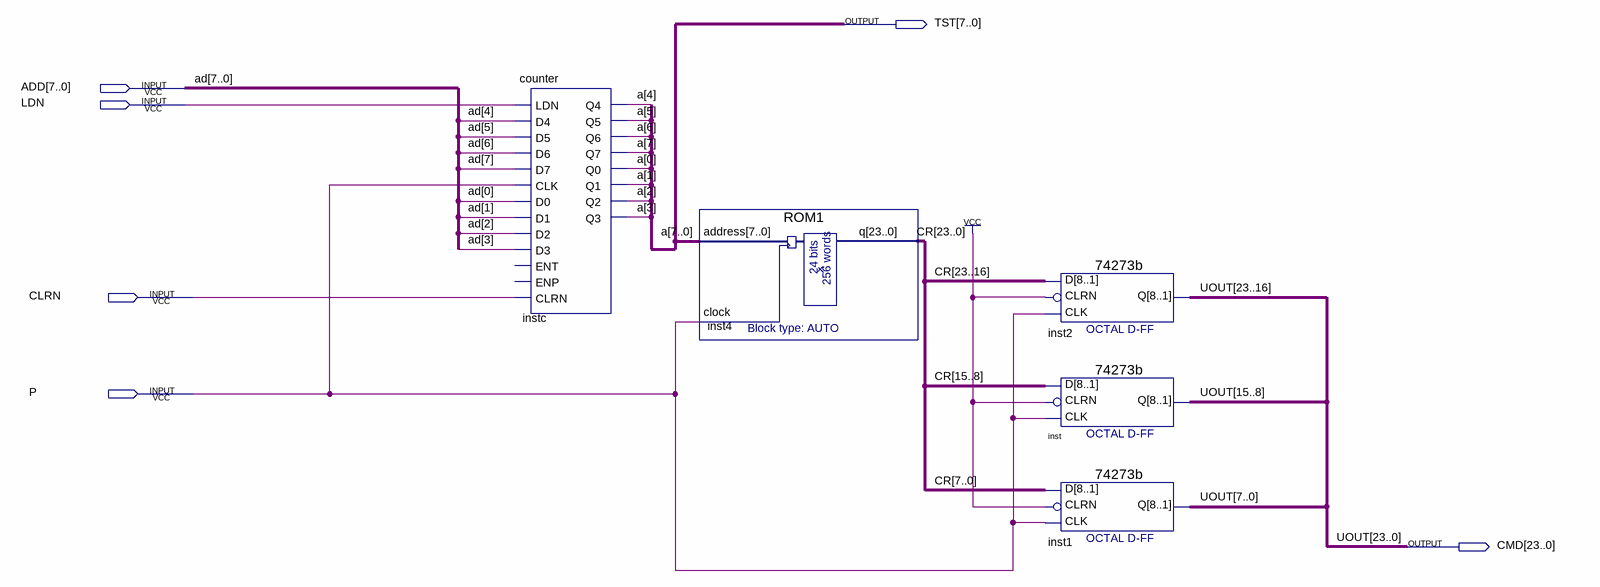
[diagram p0: schematic sheet]
// Quartus schematic 8RromR24.bdf as structural Verilog: 5 symbols, 6 pins
module \8RromR24  (
  input  [7:0] ADD,
  input  LDN,
  input  CLRN,
  input  P,
  output [7:0] TST,
  output [23:0] CMD
);

  wire [23:0] CR;

  counter instc (
    .LDN(LDN), .D4(ADD[4]), .D5(ADD[5]), .D6(ADD[6]), .D7(ADD[7]), .CLK(P), .D0(ADD[0]), .D1(ADD[1]),
    .D2(ADD[2]), .D3(ADD[3]), .CLRN(CLRN), .Q4(TST[4]), .Q5(TST[5]), .Q6(TST[6]), .Q7(TST[7]), .Q0(TST[0]),
    .Q1(TST[1]), .Q2(TST[2]), .Q3(TST[3]));  // open: ENT, ENP
  ROM1 inst4 (.address(TST), .clock(P), .q(CR));
  \74273b  inst2 (.CLK(P), .D(CR[23:16]), .CLRN(1'b1), .Q(CMD[23:16]));
  \74273b  inst (.CLK(P), .D(CR[15:8]), .CLRN(1'b1), .Q(CMD[15:8]));
  \74273b  inst1 (.CLK(P), .D(CR[7:0]), .CLRN(1'b1), .Q(CMD[7:0]));

  // Other names for the same wires on the sheet: a[7:0] = TST; ad[7:0] = ADD; UOUT[23:0] = CMD
endmodule
